# Altium project Electric_Interface_Lio.PrjPcb
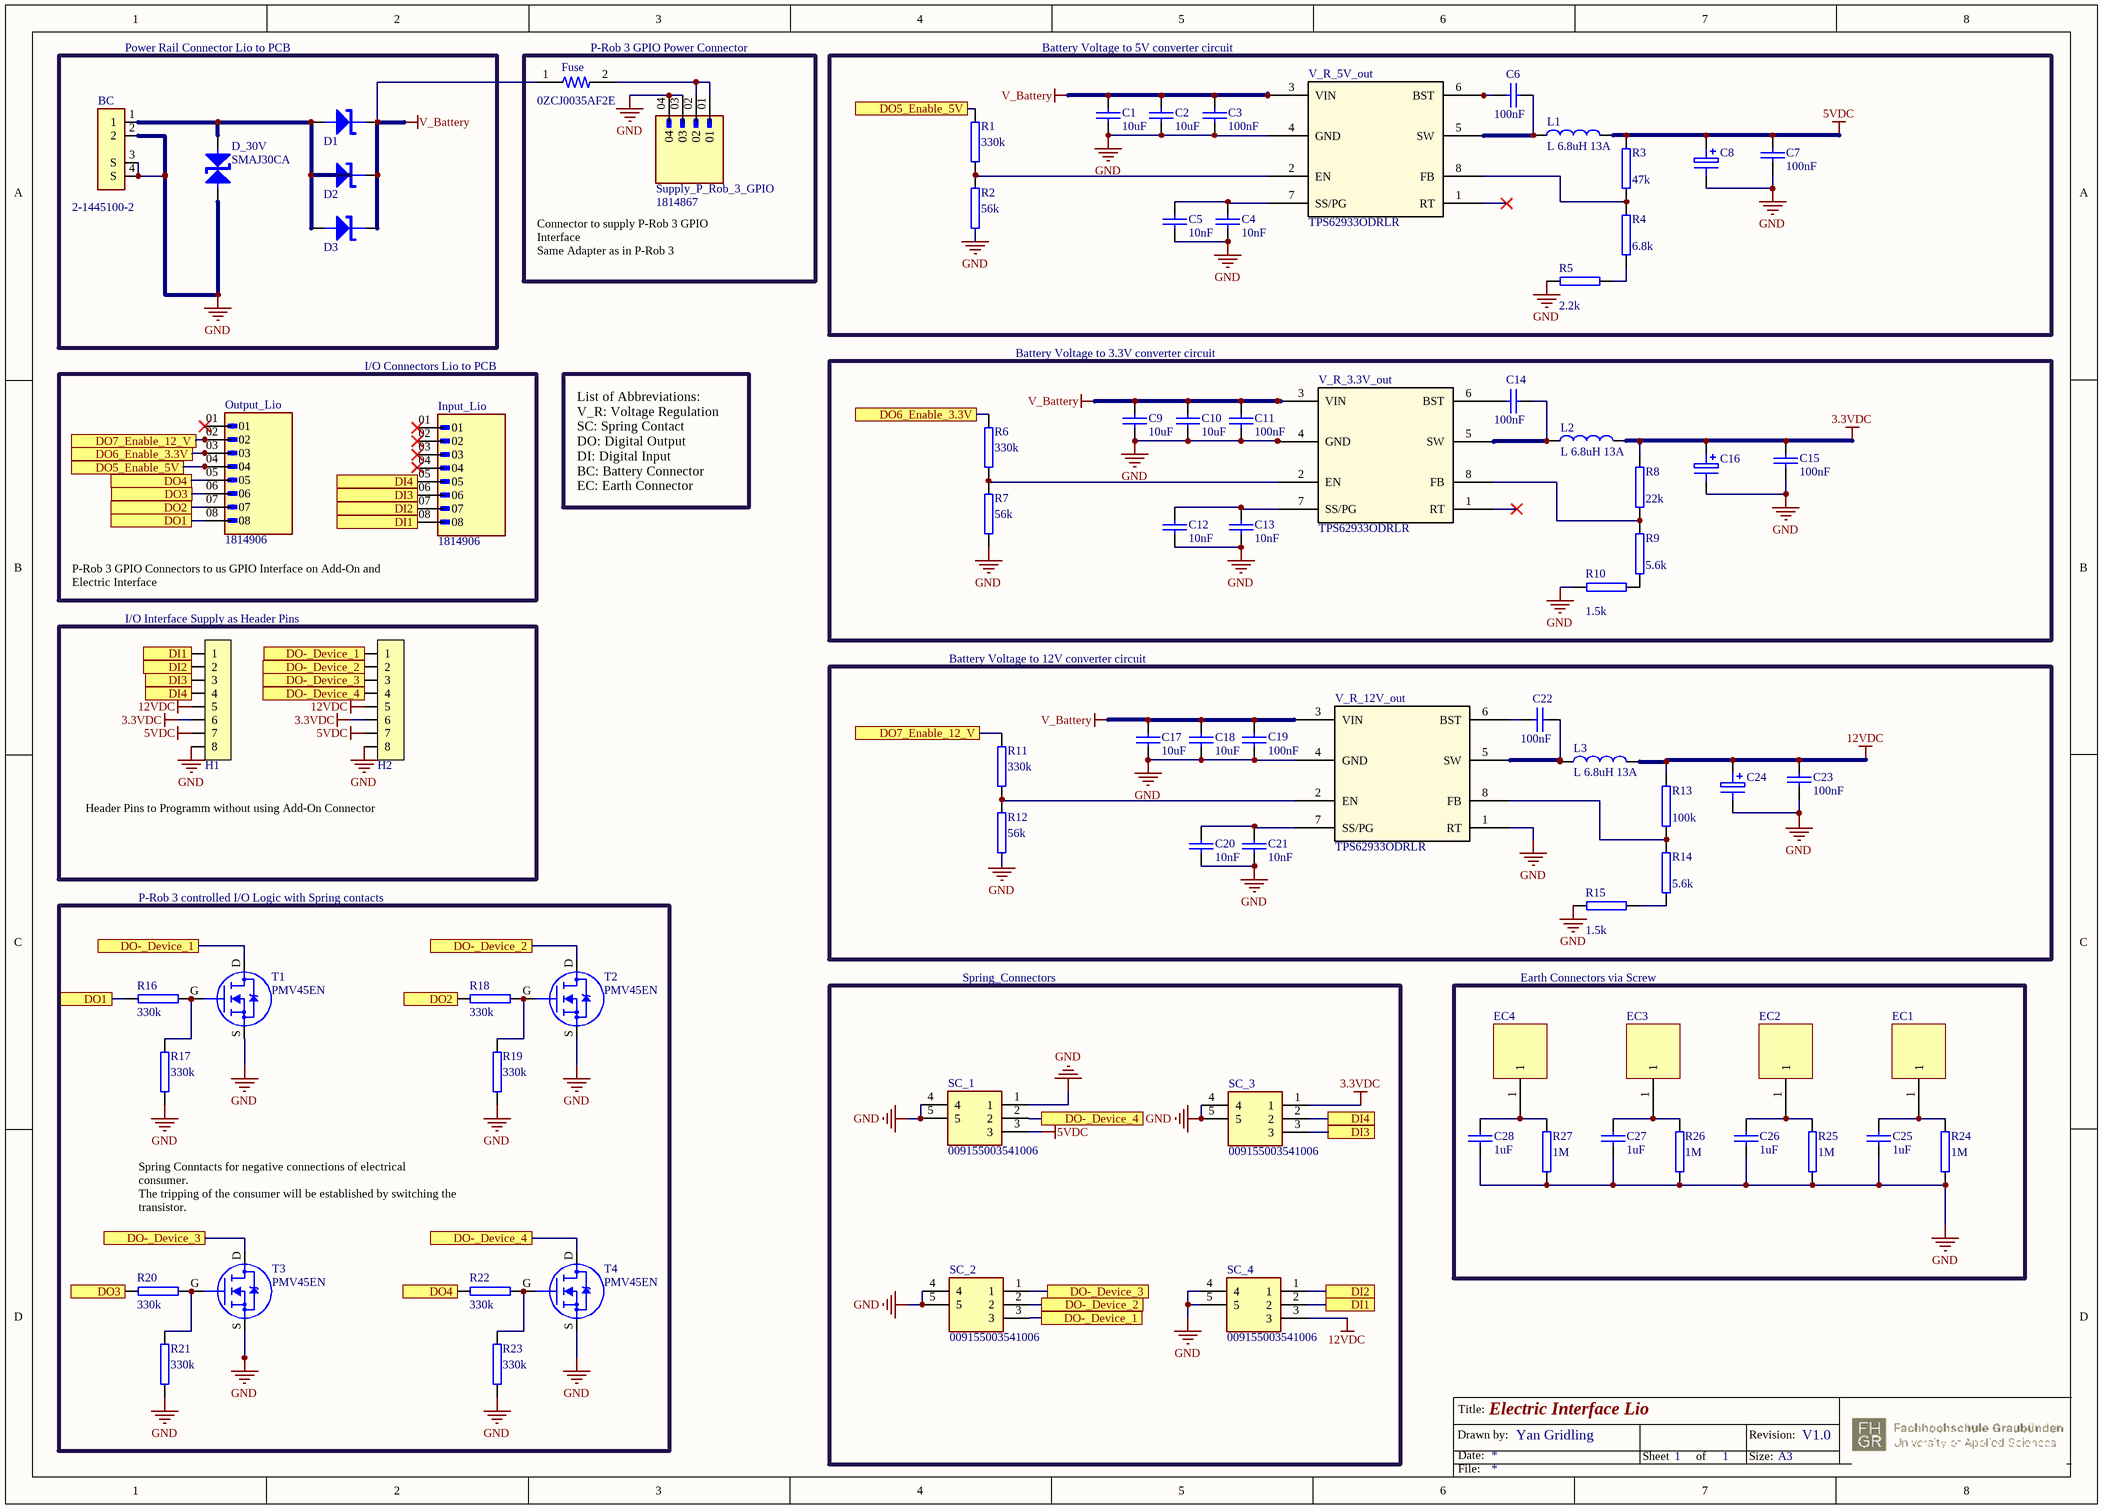
[diagram p0: Schematic_Interface_Lio_with_IC.SchDoc]
1 sheet, 84 parts. Net scope: flat (ports and power ports of the same name join across sheets).
Board file: PCB_Interface_Lio.PcbDoc

## Sheet Schematic_Interface_Lio_with_IC.SchDoc: Electric Interface Lio
size A3; Date: 18.07.2017; DrawnBy: Yan Gridling; Organization: HTW Chur; Address1: Pulvermühlestrasse 57; Address2: 7004 Chur; Address3: Switzerland; DocumentNumber: 1; Revision: V1.0; SheetNumber: 1; SheetTotal: 1; DocumentName: HTW Template

### Parts
BC  2-1445100-2  [2-1445100-2]
C1  value 10uF  [C_1210_A]  (hidden comment: C 10uF 1210)
C2  value 10uF  [C_1210_A]  (hidden comment: C 10uF 1210)
C3  value 100nF  [0603]  (hidden comment: C 100nF 0603)
C4  value 10nF  [0603]  (hidden comment: C 10nF 0603)
C5  value 10nF  [0603]  (hidden comment: C 10nF 0603)
C6  value 100nF  [0603]  (hidden comment: C 100nF 0603)
C7  value 100nF  [0603]  (hidden comment: C 100nF 0603)
C8  C 47uF ALUM  [HA1C470WR]  (value not drawn)
C9  value 10uF  [C_1210_A]  (hidden comment: C 10uF 1210)
C10  value 10uF  [C_1210_A]  (hidden comment: C 10uF 1210)
C11  value 100nF  [0603]  (hidden comment: C 100nF 0603)
C12  value 10nF  [0603]  (hidden comment: C 10nF 0603)
C13  value 10nF  [0603]  (hidden comment: C 10nF 0603)
C14  value 100nF  [0603]  (hidden comment: C 100nF 0603)
C15  value 100nF  [0603]  (hidden comment: C 100nF 0603)
C16  C 47uF ALUM  [HA1C470WR]  (value not drawn)
C17  value 10uF  [C_1210_A]  (hidden comment: C 10uF 1210)
C18  value 10uF  [C_1210_A]  (hidden comment: C 10uF 1210)
C19  value 100nF  [0603]  (hidden comment: C 100nF 0603)
C20  value 10nF  [0603]  (hidden comment: C 10nF 0603)
C21  value 10nF  [0603]  (hidden comment: C 10nF 0603)
C22  value 100nF  [0603]  (hidden comment: C 100nF 0603)
C23  value 100nF  [0603]  (hidden comment: C 100nF 0603)
C24  C 47uF ALUM  [HA1C470WR]  (value not drawn)
C25  value 1uF  [0603]  (hidden comment: C 1uF 0603)
C26  value 1uF  [0603]  (hidden comment: C 1uF 0603)
C27  value 1uF  [0603]  (hidden comment: C 1uF 0603)
C28  value 1uF  [0603]  (hidden comment: C 1uF 0603)
D1  Schottky 60V/2A  [SOD-123FL]  (value not drawn)
D2  Schottky 60V/2A  [SOD-123FL]  (value not drawn)
D3  Schottky 60V/2A  [SOD-123FL]  (value not drawn)
D_30V  SMAJ30CA  [SMA]
EC1  Screw_Earth_Connection  [Screw_Earth_Connector_Pad]  (value not drawn)
EC2  Screw_Earth_Connection  [Screw_Earth_Connector_Pad]  (value not drawn)
EC3  Screw_Earth_Connection  [Screw_Earth_Connector_Pad]  (value not drawn)
EC4  Screw_Earth_Connection  [Screw_Earth_Connector_Pad]  (value not drawn)
Fuse  0ZCJ0035AF2E  [RESC3216X125N]
H1  8Pin_Male  [Header1x8_254]  (value not drawn)
H2  8Pin_Male  [Header1x8_254]  (value not drawn)
Input_Lio  1814906  [PHOENIX_1814906]
L1  L 6.8uH 13A  [SRP1040VA-6R8M]
L2  L 6.8uH 13A  [SRP1040VA-6R8M]
L3  L 6.8uH 13A  [SRP1040VA-6R8M]
Output_Lio  1814906  [PHOENIX_1814906]
R1  value 330k  [0805]  (hidden comment: R 330K 0805)
R2  value 56k  [0805]  (hidden comment: R 56K 0805)
R3  value 47k  [0805]  (hidden comment: R 47K 0805)
R4  value 6.8k  [0805]  (hidden comment: R 6K8 0805)
R5  value 2.2k  [0805]  (hidden comment: R 2K2 0805)
R6  value 330k  [0805]  (hidden comment: R 330K 0805)
R7  value 56k  [0805]  (hidden comment: R 56K 0805)
R8  value 22k  [0805]  (hidden comment: R 22K 0805)
R9  value 5.6k  [0805]  (hidden comment: R 5K6 0805)
R10  value 1.5k  [0805]  (hidden comment: R 1K5 0805)
R11  value 330k  [0805]  (hidden comment: R 330K 0805)
R12  value 56k  [0805]  (hidden comment: R 56K 0805)
R13  value 100k  [0805]  (hidden comment: R 100K 0805)
R14  value 5.6k  [0805]  (hidden comment: R 5K6 0805)
R15  value 1.5k  [0805]  (hidden comment: R 1K5 0805)
R16  value 330k  [0805]  (hidden comment: R 330K 0805)
R17  value 330k  [0805]  (hidden comment: R 330K 0805)
R18  value 330k  [0805]  (hidden comment: R 330K 0805)
R19  value 330k  [0805]  (hidden comment: R 330K 0805)
R20  value 330k  [0805]  (hidden comment: R 330K 0805)
R21  value 330k  [0805]  (hidden comment: R 330K 0805)
R22  value 330k  [0805]  (hidden comment: R 330K 0805)
R23  value 330k  [0805]  (hidden comment: R 330K 0805)
R24  value 1M  [0805]  (hidden comment: R 1M 0805)
R25  value 1M  [0805]  (hidden comment: R 1M 0805)
R26  value 1M  [0805]  (hidden comment: R 1M 0805)
R27  value 1M  [0805]  (hidden comment: R 1M 0805)
SC_1  009155003541006  [009155003541006]
SC_2  009155003541006  [009155003541006]
SC_3  009155003541006  [009155003541006]
SC_4  009155003541006  [009155003541006]
Supply_P_Rob_3_GPIO  1814867  [PHOENIX_1814867]
T1  PMV45EN  [SOT-23-FET]
T2  PMV45EN  [SOT-23-FET]
T3  PMV45EN  [SOT-23-FET]
T4  PMV45EN  [SOT-23-FET]
V_R_3.3V_out  TPS62933ODRLR  [SOT5X3-8_DRL_TEX]
V_R_5V_out  TPS62933ODRLR  [SOT5X3-8_DRL_TEX]
V_R_12V_out  TPS62933ODRLR  [SOT5X3-8_DRL_TEX]

### Blocks framed on the sheet
Power Rail Connector Lio to PCB: BC D1-D3 D_30V
P-Rob 3 GPIO Power Connector: Fuse Supply_P_Rob_3_GPIO
Battery Voltage to 5V converter circuit: C1-C8 L1 R1-R5 V_R_5V_out
I/O Connectors Lio to PCB: Input_Lio Output_Lio
Battery Voltage to 3.3V converter circuit: C9-C16 L2 R6-R10 V_R_3.3V_out
I/O Interface Supply as Header Pins: H1 H2
Battery Voltage to 12V converter circuit: C17-C24 L3 R11-R15 V_R_12V_out
P-Rob 3 controlled I/O Logic with Spring contacts: R16-R23 T1-T4
Spring_Connectors: SC_1-SC_4
Earth Connectors via Screw: C25-C28 EC1-EC4 R24-R27

### Ports
DI1 (see Schematic_Interface_Lio_with_IC[1B], Schematic_Interface_Lio_with_IC[2B]), DI1 (see Schematic_Interface_Lio_with_IC[1B], Schematic_Interface_Lio_with_IC[6D]), DI1 (see Schematic_Interface_Lio_with_IC[2B], Schematic_Interface_Lio_with_IC[6D]), DI2 (see Schematic_Interface_Lio_with_IC[1B], Schematic_Interface_Lio_with_IC[2B]), DI2 (see Schematic_Interface_Lio_with_IC[1B], Schematic_Interface_Lio_with_IC[6D]), DI2 (see Schematic_Interface_Lio_with_IC[2B], Schematic_Interface_Lio_with_IC[6D]), DI3 (see Schematic_Interface_Lio_with_IC[1B], Schematic_Interface_Lio_with_IC[2B]), DI3 (see Schematic_Interface_Lio_with_IC[1B], Schematic_Interface_Lio_with_IC[6D]), DI3 (see Schematic_Interface_Lio_with_IC[2B], Schematic_Interface_Lio_with_IC[6D]), DI4 (see Schematic_Interface_Lio_with_IC[1B], Schematic_Interface_Lio_with_IC[2B]), DI4 (see Schematic_Interface_Lio_with_IC[1B], Schematic_Interface_Lio_with_IC[6C]), DI4 (see Schematic_Interface_Lio_with_IC[2B], Schematic_Interface_Lio_with_IC[6C]), DO1 (see Schematic_Interface_Lio_with_IC[1B]), DO1 (see Schematic_Interface_Lio_with_IC[1C]), DO2 (see Schematic_Interface_Lio_with_IC[1B]), DO2 (see Schematic_Interface_Lio_with_IC[2C]), DO3 (see Schematic_Interface_Lio_with_IC[1B]), DO3 (see Schematic_Interface_Lio_with_IC[1D]), DO4 (see Schematic_Interface_Lio_with_IC[1B]), DO4 (see Schematic_Interface_Lio_with_IC[2D]), DO5_Enable_5V (see Schematic_Interface_Lio_with_IC[1B]), DO5_Enable_5V (see Schematic_Interface_Lio_with_IC[4A]), DO6_Enable_3.3V (see Schematic_Interface_Lio_with_IC[1B]), DO6_Enable_3.3V (see Schematic_Interface_Lio_with_IC[4B]), DO7_Enable_12_V (see Schematic_Interface_Lio_with_IC[1B]), DO7_Enable_12_V (see Schematic_Interface_Lio_with_IC[4B]), DO-_Device_1 (see Schematic_Interface_Lio_with_IC[1B], Schematic_Interface_Lio_with_IC[1C]), DO-_Device_1 (see Schematic_Interface_Lio_with_IC[1B], Schematic_Interface_Lio_with_IC[4D]), DO-_Device_1 (see Schematic_Interface_Lio_with_IC[1C], Schematic_Interface_Lio_with_IC[4D]), DO-_Device_2 (see Schematic_Interface_Lio_with_IC[1B], Schematic_Interface_Lio_with_IC[2C]), DO-_Device_2 (see Schematic_Interface_Lio_with_IC[1B], Schematic_Interface_Lio_with_IC[4D]), DO-_Device_2 (see Schematic_Interface_Lio_with_IC[2C], Schematic_Interface_Lio_with_IC[4D]), DO-_Device_3 (see Schematic_Interface_Lio_with_IC[1B], Schematic_Interface_Lio_with_IC[1D]), DO-_Device_3 (see Schematic_Interface_Lio_with_IC[1B], Schematic_Interface_Lio_with_IC[4D]), DO-_Device_3 (see Schematic_Interface_Lio_with_IC[1D], Schematic_Interface_Lio_with_IC[4D]), DO-_Device_4 (see Schematic_Interface_Lio_with_IC[1B], Schematic_Interface_Lio_with_IC[2D]), DO-_Device_4 (see Schematic_Interface_Lio_with_IC[1B], Schematic_Interface_Lio_with_IC[4C]), DO-_Device_4 (see Schematic_Interface_Lio_with_IC[2D], Schematic_Interface_Lio_with_IC[4C])

### Nets
3.3VDC: C15.1 C16.1 H1.6 H2.6 L2.2 R8.2 SC_3.1
5VDC: C7.1 C8.1 H1.7 H2.7 L1.2 R3.2 SC_1.3
12VDC: C23.1 C24.1 H1.5 H2.5 L3.2 R13.2 SC_4.3
GND: BC.2 BC.3(S) BC.4(S) C1.2 C2.2 C3.2 C4.2 C5.2 C7.2 C8.2 C9.2 C10.2 C11.2 C12.2 C13.2 C15.2 C16.2 C17.2 C18.2 C19.2 C20.2 C21.2 C23.2 C24.2 C25.2 C26.1 C27.1 C28.1 D_30V.K H1.8 H2.8 R2.2 R5.1 R7.2 R10.1 R12.2 R15.1 R17.1 R19.2 R21.1 R23.2 R24.2 R25.2 R26.2 R27.2 SC_1.1 SC_1.4 SC_1.5 SC_2.4 SC_2.5 SC_3.4 SC_3.5 SC_4.4 SC_4.5 Supply_P_Rob_3_GPIO.03 Supply_P_Rob_3_GPIO.04 T1.S T2.S T3.S T4.S V_R_3.3V_out.4(GND) V_R_5V_out.4(GND) V_R_12V_out.1(RT) V_R_12V_out.4(GND)
V_Battery: C1.1 C2.1 C3.1 C9.1 C10.1 C11.1 C17.1 C18.1 C19.1 D1.K D2.K D3.K Fuse.1 V_R_3.3V_out.3(VIN) V_R_5V_out.3(VIN) V_R_12V_out.3(VIN)
NetBC_1: BC.1 D1.A D2.A D3.A D_30V.A
NetC4_1: C4.1 C5.1 V_R_5V_out.7(SS/PG)
NetC6_1: C6.1 V_R_5V_out.6(BST)
NetC6_2: C6.2 L1.1 V_R_5V_out.5(SW)
NetC12_1: C12.1 C13.1 V_R_3.3V_out.7(SS/PG)
NetC14_1: C14.1 V_R_3.3V_out.6(BST)
NetC14_2: C14.2 L2.1 V_R_3.3V_out.5(SW)
NetC20_1: C20.1 C21.1 V_R_12V_out.7(SS/PG)
NetC22_1: C22.1 V_R_12V_out.6(BST)
NetC22_2: C22.2 L3.1 V_R_12V_out.5(SW)
NetC25_1: C25.1 EC1.1 R24.1
NetC26_2: C26.2 EC2.1 R25.1
NetC27_2: C27.2 EC3.1 R26.1
NetC28_2: C28.2 EC4.1 R27.1
NetFuse_2: Fuse.2 Supply_P_Rob_3_GPIO.01 Supply_P_Rob_3_GPIO.02
NetH1_1: H1.1 Input_Lio.08 SC_4.2 ; port DI1
NetH1_2: H1.2 Input_Lio.07 SC_4.1 ; port DI2
NetH1_3: H1.3 Input_Lio.06 SC_3.3 ; port DI3
NetH1_4: H1.4 Input_Lio.05 SC_3.2 ; port DI4
NetH2_1: H2.1 SC_2.3 T1.D ; port DO-_Device_1
NetH2_2: H2.2 SC_2.2 T2.D ; port DO-_Device_2
NetH2_3: H2.3 SC_2.1 T3.D ; port DO-_Device_3
NetH2_4: H2.4 SC_1.2 T4.D ; port DO-_Device_4
NetOutput_Lio_02: Output_Lio.02 R11.1 ; port DO7_Enable_12_V
NetOutput_Lio_03: Output_Lio.03 R6.1 ; port DO6_Enable_3.3V
NetOutput_Lio_04: Output_Lio.04 R1.1 ; port DO5_Enable_5V
NetOutput_Lio_05: Output_Lio.05 R22.2 ; port DO4
NetOutput_Lio_06: Output_Lio.06 R20.1 ; port DO3
NetOutput_Lio_07: Output_Lio.07 R18.2 ; port DO2
NetOutput_Lio_08: Output_Lio.08 R16.1 ; port DO1
NetR1_2: R1.2 R2.1 V_R_5V_out.2(EN)
NetR3_1: R3.1 R4.2 V_R_5V_out.8(FB)
NetR4_1: R4.1 R5.2
NetR6_2: R6.2 R7.1 V_R_3.3V_out.2(EN)
NetR8_1: R8.1 R9.2 V_R_3.3V_out.8(FB)
NetR9_1: R9.1 R10.2
NetR11_2: R11.2 R12.1 V_R_12V_out.2(EN)
NetR13_1: R13.1 R14.2 V_R_12V_out.8(FB)
NetR14_1: R14.1 R15.2
NetR16_2: R16.2 R17.2 T1.G
NetR18_1: R18.1 R19.1 T2.G
NetR20_2: R20.2 R21.2 T3.G
NetR22_1: R22.1 R23.1 T4.G

Not connected (* = marked no-connect by the designer): Input_Lio 01* 02* 03* 04*; Output_Lio 01*; V_R_3.3V_out 1(RT)*; V_R_5V_out 1(RT)*

### Notes on the sheet
- Connector to supply P-Rob 3 GPIO Interface
  Same Adapter as in P-Rob 3
- List of Abbreviations:
  V_R: Voltage Regulation
  SC: Spring Contact
  DO: Digital Output
  DI: Digital Input
  BC: Battery Connector
  EC: Earth Connector
- (near Output_Lio) P-Rob 3 GPIO Connectors to us GPIO Interface on Add-On and Electric Interface
- Header Pins to Programm without using Add-On Connector
- Spring Conntacts for negative connections of electrical consumer.
  The tripping of the consumer will be established by switching the transistor.
- Drawn by:
- Title:
- Date:
- Sheet
- of
- Size:
- Revision:
- A3
- File:

### Library data of the parts
BC = 2-1445100-2: Micro MATE-N-LOK 2 Position Surface Mount Single Row Straight 3 mm Pin Header; MF: TE Connectivity; MP: 2-1445053-2; SnapEDA_Link: https://www.snapeda.com/parts/2-1445053-2/TE%20Connectivity%20AMP%20Connectors/view-part/2550164/?ref=snap; Availability: Warning; Price: None; Value: *; Check_prices: https://www.snapeda.com/parts/2-1445053-2/TE%20Connectivity%20AMP%20Connectors/view-part/2550164/?ref=eda; Package: None; Purchase-URL: https://pricing.snapeda.com/search/part/2-1445053-2/?ref=eda
C1 C2 C9 C10 C17 C18 = C_10uF_1210: TempKoeff: X7S; Tolerance: 10%; Voltage: 50V; Part ID: C_10uF_1210; Price 1pc (CHF): 0.81; Supplier 1: Digi-Key; Supplier Part Number 1: 445-7004-1-ND
C3 C6 C7 C11 C14 C15 C19 C22 C23 = C_100nF_0603: TempKoeff: Y5V; Tolerance: -20%/+80%; Voltage: 50V; Part ID: C_100nF_0603; Price 1pc (CHF): 0.1; Supplier 1: Digi-Key; Supplier Part Number 1: 1276-1012-1-ND
C4 C5 C12 C13 C20 C21 = C_10000pF_0603: TempKoeff: X7R; Tolerance: 10%; Voltage: 50V; Part ID: C_10000pF_0603; Price 1pc (CHF): 0.10; Supplier 1: Digi-Key; Supplier Part Number 1: 1276-1009-1-ND
C8 C16 C24 = C_47uF_ALUM: Tolerance: 20%; Voltage: 16V; VALUE: 47uF; Part ID: C_47uF_ALUM; Price 1pc (CHF): 0.08; Supplier 1: Digi-Key; Supplier Part Number 1: PCE4190TR-ND
C25-C28 = C_1uF_0603: TempKoeff: X7R; Tolerance: 10%; Voltage: 25V; Part ID: C_1uF_0603; Price 1pc (CHF): 0.29; Supplier 1: Digi-Key; Supplier Part Number 1: 1276-6617-1-ND
D1-D3 = D_NTS260ESF: Voltage: 60V; Current: 2A; Forward Voltage: 550mV@2A; Part ID: D_NTS260ESF; Price 10pcs: 0.364; Supplier 1: Digi-Key; ComponentLink1Description: Datasheet; ComponentLink1URL: https://www.onsemi.com/pub/Collateral/NTS260ESF-D.PDF; Supplier Part Number 1: RBR2MM60CTR-ND
D_30V = D_SMAJ30CA: Cera Diode 30 Volt Overvoltage protection.; Voltage: 30V; Current: 4.1A; Part ID: D_SMAJ30CA; Price 10pcs: 0.357; Supplier 1: Digi-Key; ComponentLink1Description: Datasheet; ComponentLink1URL: https://www.littelfuse.com/~/media/electronics/datasheets/tvs_diodes/littelfuse_tvs_diode_smaj_datasheet.pdf.pdf; Supplier Part Number 1: SMAJ30CALFCT-ND
Fuse = 0ZCJ0035AF2E: 1206 SMT PPTC | 0.35 Ih | 30V; MF: Bel Fuse; MP: 0ZCJ0035AF2E; Package: 1206 Bel Fuse; SnapEDA_Link: https://www.snapeda.com/parts/0ZCJ0035AF2E/Bel%20Fuse%20Inc./view-part/703881/?ref=snap; Value: *; ComponentLink1Description: https://www.mouser.ch/ProductDetail/Bel-Fuse/0ZCJ0035AF2E?qs=SRYZG9HaIQ1eeV%2FMwyYkuw%3D%3D; ComponentLink1URL: *
H1 H2 = ArduinoConnector_8: Part ID: ArduinoConnector_8; Price 1pc (CHF): 0.36; Supplier 1: Digi-Key; ComponentLink1Description: Datasheet; ComponentLink1URL: https://katalog.we-online.de/em/datasheet/6130xx11121.pdf; Supplier Part Number 1: 732-5321-ND
Input_Lio Output_Lio = 1814906: MF: {'manufacturer': u'Phoenix Contact'}; Package: None; Price: None; Value: *; MP: 1814906; Availability: Unavailable; ComponentLink1Description: https://www.phoenixcontact.com/en-us/products/pcb-header-ptsm-05-8-hh-25-thr-wh-r44-1814906; ComponentLink1URL: *
L1-L3 = SRP1040VA-6R8M: ComponentLink1Description: https://www.bourns.com/docs/product-datasheets/srp1040va.pdf; ComponentLink1URL: *
R1 R6 R11 R16-R23 = R_330k_0805: Tolerance: 1%; Power Dissipation: 125mW; Part ID: R_330k_0805; Price 10pcs (CHF): 0.042; Supplier 1: Digi-Key; Supplier Part Number 1: 311-330KCRCT-ND
R2 R7 R12 = R_56k_0805: Tolerance: 1%; Power Dissipation: 125mW; Part ID: R_56k_0805; Price 10pcs (CHF): 0.045; Supplier 1: Digi-Key; Supplier Part Number 1: 311-56.0KCRCT-ND
R3 = R_47k_0805: Tolerance: 1%; Power Dissipation: 125mW; Part ID: R_47k_0805; Price 10pcs (CHF): 0.09; Supplier 1: Digi-Key; Supplier Part Number 1: A106064CT-ND
R4 = R_6k8_0805: Tolerance: 1%; Power Dissipation: 125mW; Part ID: R_6k8_0805; Price 10pcs (CHF): 0.068; Supplier 1: Digi-Key; Supplier Part Number 1: A126384CT-ND
R5 = R_2k2_0805: Tolerance: 1%; Power Dissipation: 125mW; Part ID: R_2k2_0805; Price 10pcs (CHF): 0.043; Supplier 1: Digi-Key; Supplier Part Number 1: 311-2.20KCRCT-ND
R8 = R_22k_0805: Tolerance: 1%; Power Dissipation: 125mW; Part ID: R_22k_0805; Price 10pcs (CHF): 0.042; Supplier 1: Digi-Key; Supplier Part Number 1: 311-22.0KCRCT-ND
R9 R14 = R_5k6_0805: Tolerance: 1%; Power Dissipation: 125mW; Part ID: R_5k6_0805; Price 10pcs (CHF): 0.051; Supplier 1: Digi-Key; Supplier Part Number 1: A126380CT-ND
R10 R15 = R_1k5_0805: Tolerance: 1%; Power Dissipation: 250mW; Part ID: R_1k5_0805; Price 10pcs (CHF): 0.072; Supplier 1: Digi-Key; Supplier Part Number 1: RNCP0805FTD1K50CT-ND
R13 = R_100k_0805: Tolerance: 1%; Power Dissipation: 125mW; Part ID: R_100k_0805; Price 10pcs (CHF): 0.042; Supplier 1: Digi-Key; Supplier Part Number 1: 311-100KCRCT-ND
R24-R27 = R_1M_0805: Tolerance: 1%; Power Dissipation: 125mW; Part ID: R_1M_0805; Price 10pcs (CHF): 0.042; Supplier 1: Digi-Key; Supplier Part Number 1: 311-1.00MCRCT-ND
SC_1-SC_4 = 009155003541006: Connector; Manufacturer_Name: Kyocera AVX; Datasheet Link: http://www.mouser.com/datasheet/2/40/RightAngle2.5mmPitch_9155-500-845733.pdf; Height: 4mm; Manufacturer_Part_Number: 009155003541006; Mouser Part Number: 581-009155003541006; Mouser Price/Stock: https://www.mouser.co.uk/ProductDetail/AVX/009155003541006?qs=aTQdX%252BfNGTp5QwJ6nid1rw%3D%3D; Arrow Part Number: 009155003541006; Arrow Price/Stock: https://www.arrow.com/en/products/009155003541006/avx
Supply_P_Rob_3_GPIO = 1814867: Pluggable Header 2.5mm 20AWG 160V 6A 4 Position COMBICON PTSM Series | Phoenix Contact 1814867; SnapEDA_Link: https://www.snapeda.com/parts/1814867/Phoenix+Contact/view-part/?ref=snap; Package: None; Value: *; MF: Phoenix Contact; MP: 1814867; Check_prices: https://www.snapeda.com/parts/1814867/Phoenix+Contact/view-part/?ref=eda; ComponentLink1Description: https://www.phoenixcontact.com/en-us/products/pcb-header-ptsm-05-4-hh-25-thr-wh-r32-1814867; ComponentLink1URL: *
T1-T4 = FET_N_CH_PMV45EN: Voltage: 30V; Current: 4.1A; Power Dissipation: 510mW; Part ID: FET_N_CH_PMV45EN; Price 1pc (CHF): 0.44; ComponentLink1URL: https://assets.nexperia.com/documents/data-sheet/PMV45EN2.pdf; ComponentLink1Description: Datasheet; Supplier 1: Digi-Key; Supplier Part Number 1: 1727-2307-1-ND
V_R_3.3V_out V_R_5V_out V_R_12V_out = TPS62933ODRLR: Buck Converter; ComponentLink1Description: https://eu.mouser.com/ProductDetail/Texas-Instruments/TPS62933ODRLR?qs=By6Nw2ByBD3VuSv7z7GudQ%3D%3D; ComponentLink1URL: *